# EAGLE design BackSlotAdapter (EAGLE 7.5.0)
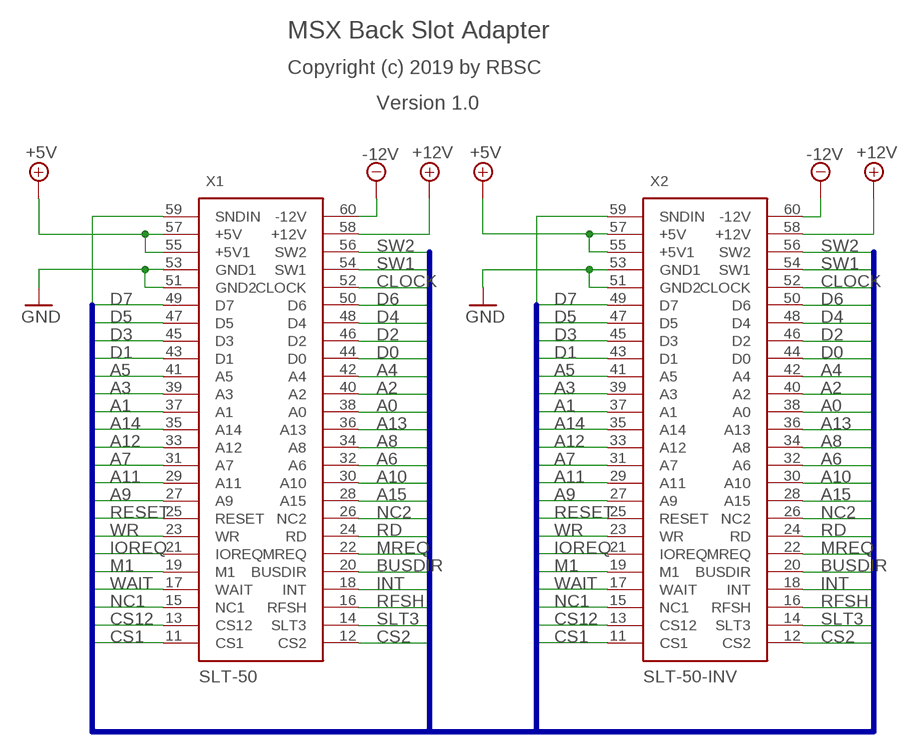
[diagram p0: schematic, sheet 1]

## Parts
X1  SLT-50  [SLT-50]
X2  SLT-50-INV  [SLT-50-INV]

## Nets
+5V: X1.55(+5V1) X1.57(+5V) X2.55(+5V1) X2.57(+5V)
+12V: X1.58(+12V) X2.58(+12V)
-12V: X1.60(-12V) X2.60(-12V)
A0: X1.38(A0) X2.38(A0)
A1: X1.37(A1) X2.37(A1)
A2: X1.40(A2) X2.40(A2)
A3: X1.39(A3) X2.39(A3)
A4: X1.42(A4) X2.42(A4)
A5: X1.41(A5) X2.41(A5)
A6: X1.32(A6) X2.32(A6)
A7: X1.31(A7) X2.31(A7)
A8: X1.34(A8) X2.34(A8)
A9: X1.27(A9) X2.27(A9)
A10: X1.30(A10) X2.30(A10)
A11: X1.29(A11) X2.29(A11)
A12: X1.33(A12) X2.33(A12)
A13: X1.36(A13) X2.36(A13)
A14: X1.35(A14) X2.35(A14)
A15: X1.28(A15) X2.28(A15)
BUSDIR: X1.20(BUSDIR) X2.20(BUSDIR)
CLOCK: X1.52(CLOCK) X2.52(CLOCK)
CS1: X1.11(CS1) X2.11(CS1)
CS2: X1.12(CS2) X2.12(CS2)
CS12: X1.13(CS12) X2.13(CS12)
D0: X1.44(D0) X2.44(D0)
D1: X1.43(D1) X2.43(D1)
D2: X1.46(D2) X2.46(D2)
D3: X1.45(D3) X2.45(D3)
D4: X1.48(D4) X2.48(D4)
D5: X1.47(D5) X2.47(D5)
D6: X1.50(D6) X2.50(D6)
D7: X1.49(D7) X2.49(D7)
GND: X1.51(GND2) X1.53(GND1) X2.51(GND2) X2.53(GND1)
INT: X1.18(INT) X2.18(INT)
IOREQ: X1.21(IOREQ) X2.21(IOREQ)
M1: X1.19(M1) X2.19(M1)
MREQ: X1.22(MREQ) X2.22(MREQ)
NC1: X1.15(NC1) X2.15(NC1)
NC2: X1.26(NC2) X2.26(NC2)
RD: X1.24(RD) X2.24(RD)
RESET: X1.25(RESET) X2.25(RESET)
RFSH: X1.16(RFSH) X2.16(RFSH)
SLT3: X1.14(SLT3) X2.14(SLT3)
SNDIN: X1.59(SNDIN) X2.59(SNDIN)
SW1: X1.54(SW1) X2.54(SW1)
SW2: X1.56(SW2) X2.56(SW2)
WAIT: X1.17(WAIT) X2.17(WAIT)
WR: X1.23(WR) X2.23(WR)

## Buses
D0,D1,D2,D3,D4,D5,D6,D7,A0,A1,A2,A3,A4,A5,A6,A7,A8,A9,A10,A11,A12,A13,A14,A15,CS1,CS2,CS12,SLT3,RFSH,WAIT,INT,M1,BUSDIR,IOREQ,MREQ,WR,RD,RESET,GND,CLOCK,SW1,SW2,SNDIN,NC2,NC1

## Notes on the sheet
- MSX Back Slot Adapter
- Copyright (c) 2019 by RBSC
- Version 1.0

## Library data of the parts
X1 = slt-50:SLT-50: 50-pin connector side slot
X2 = slt-50-inv:SLT-50-INV: 50-pin connector side slot

## Board
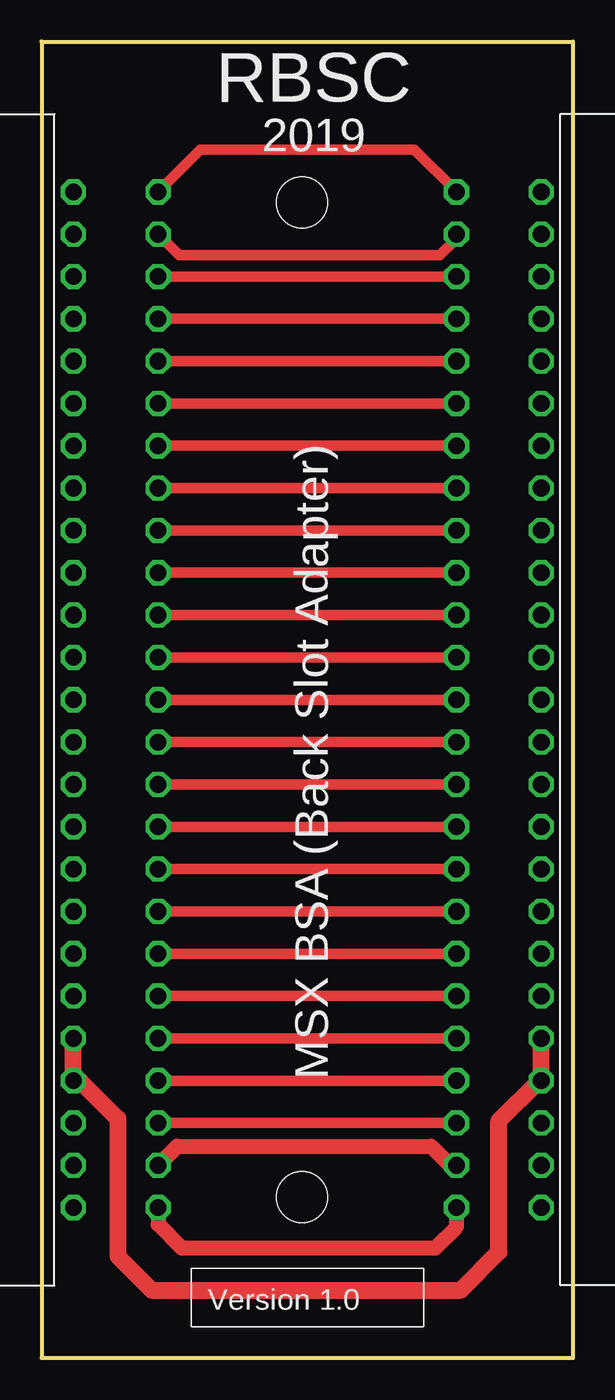
[diagram p1: board, top side]
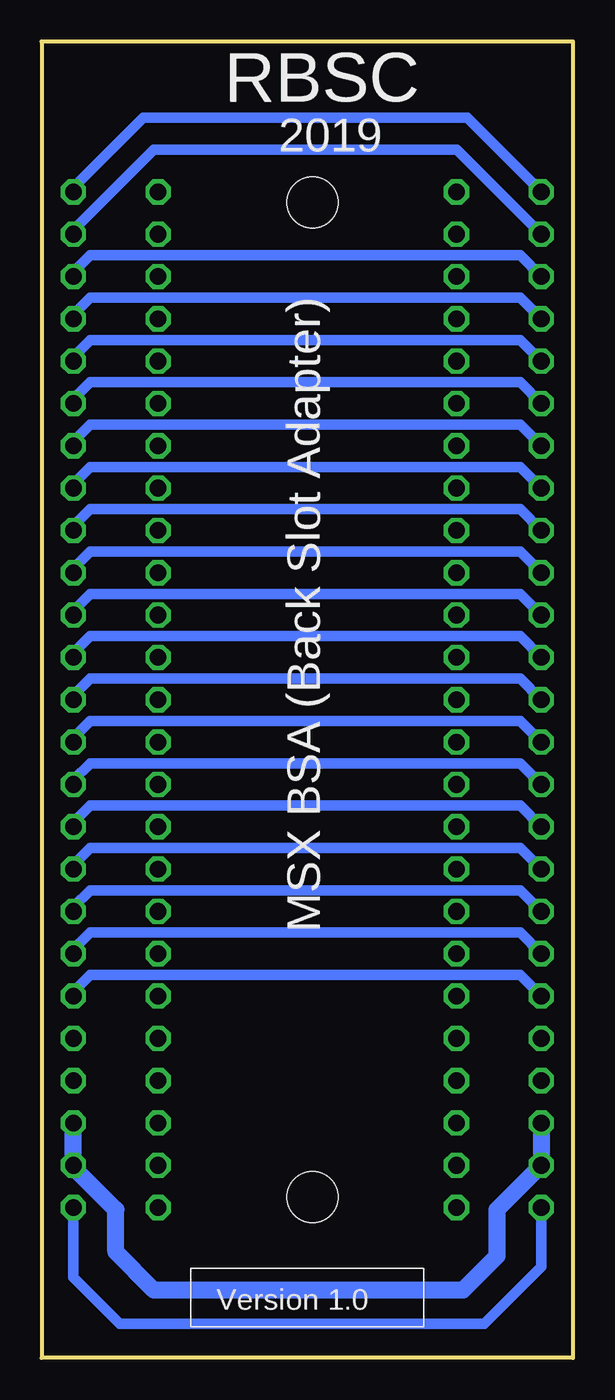
[diagram p2: board, bottom side, seen from below]

Size 31.88 x 78.99 mm. Coordinates in mm from the lower left corner, seen from the top.
Outline: 0,78.99 0,0 31.88,0 31.88,78.99 0,78.99
Copper layers (1*16): Top 0.035mm / dielectric 1.5mm / Bottom 0.035mm
Design rules "default *": minimum track width 10mil, minimum drill 24mil, track to track 7mil, track to pad 8mil, pad to pad 8mil, via to via 8mil, smd to smd 8mil, copper to edge 4mil, drill to drill 8mil, minimum pad ring 10mil, minimum via ring 8mil, stop-mask expansion 4mil, vias tented up to drill 24mil, thermal gap 10mil
Holes 3.05 mm at 15.62,9.65 15.62,69.34

### Footprints (pad centres in the part's own frame; a part is rotated, then mirrored left to right if it is on the bottom)
SLT-50 = drill 1 octagon: 11 -24.13,6.35; 12 -24.13,1.27; 13 -21.59,6.35; 14 -21.59,1.27; 15 -19.05,6.35; 16 -19.05,1.27; 17 -16.51,6.35; 18 -16.51,1.27; 19 -13.97,6.35; 20 -13.97,1.27; 21 -11.43,6.35; 22 -11.43,1.27; 23 -8.89,6.35; 24 -8.89,1.27; 25 -6.35,6.35; 26 -6.35,1.27; 27 -3.81,6.35; 28 -3.81,1.27; 29 -1.27,6.35; 30 -1.27,1.27; 31 1.27,6.35; 32 1.27,1.27; 33 3.81,6.35; 34 3.81,1.27; 35 6.35,6.35; 36 6.35,1.27; 37 8.89,6.35; 38 8.89,1.27; 39 11.43,6.35; 40 11.43,1.27; 41 13.97,6.35; 42 13.97,1.27; 43 16.51,6.35; 44 16.51,1.27; 45 19.05,6.35; 46 19.05,1.27; 47 21.59,6.35; 48 21.59,1.27; 49 24.13,6.35; 50 24.13,1.27; 51 26.67,6.35; 52 26.67,1.27; 53 29.21,6.35; 54 29.21,1.27; 55 31.75,6.35; 56 31.75,1.27; 57 34.29,6.35; 58 34.29,1.27; 59 36.83,6.35; 60 36.83,1.27
SLT-50-INV = drill 1 octagon: 11 -24.13,6.35; 12 -24.13,1.27; 13 -21.59,6.35; 14 -21.59,1.27; 15 -19.05,6.35; 16 -19.05,1.27; 17 -16.51,6.35; 18 -16.51,1.27; 19 -13.97,6.35; 20 -13.97,1.27; 21 -11.43,6.35; 22 -11.43,1.27; 23 -8.89,6.35; 24 -8.89,1.27; 25 -6.35,6.35; 26 -6.35,1.27; 27 -3.81,6.35; 28 -3.81,1.27; 29 -1.27,6.35; 30 -1.27,1.27; 31 1.27,6.35; 32 1.27,1.27; 33 3.81,6.35; 34 3.81,1.27; 35 6.35,6.35; 36 6.35,1.27; 37 8.89,6.35; 38 8.89,1.27; 39 11.43,6.35; 40 11.43,1.27; 41 13.97,6.35; 42 13.97,1.27; 43 16.51,6.35; 44 16.51,1.27; 45 19.05,6.35; 46 19.05,1.27; 47 21.59,6.35; 48 21.59,1.27; 49 24.13,6.35; 50 24.13,1.27; 51 26.67,6.35; 52 26.67,1.27; 53 29.21,6.35; 54 29.21,1.27; 55 31.75,6.35; 56 31.75,1.27; 57 34.29,6.35; 58 34.29,1.27; 59 36.83,6.35; 60 36.83,1.27

### Placement (x,y rotation side)
X1  8.26,45.85 270 bottom
X2  23.62,45.85 270 top

### Tracks (layer width: path | path; a pad name or v marks a point on that pad's centre or on a via)
+5V
  Bottom 1.016: X1.55 X1.57 4.57,8.89 4.57,6.1 6.6,4.06 25.15,4.06 27.43,6.35 27.43,8.89 29.97,11.43 X2.57 X2.55
+12V
  Top 0.889: X1.58 8.13,12.7 23.37,12.7 24.51,11.56 X2.58
-12V
  Top 0.889: X1.60 6.98,8 8.38,6.6 23.62,6.6 24.89,7.87 X2.60
A0
  Top 0.635: X1.38 X2.38
A1
  Bottom 0.635: X1.37 3.17,38.23 28.96,38.23 29.97,37.21 X2.37
A2
  Top 0.635: X1.40 X2.40
A3
  Bottom 0.635: X1.39 3.17,35.69 28.96,35.69 29.97,34.67 X2.39
A4
  Top 0.635: X1.42 X2.42
A5
  Bottom 0.635: X1.41 3.17,33.15 28.96,33.15 29.97,32.13 X2.41
A6
  Top 0.635: X1.32 X2.32
A7
  Bottom 0.635: X1.31 3.17,45.85 28.96,45.85 29.97,44.83 X2.31
A8
  Top 0.635: X1.34 X2.34
A9
  Bottom 0.635: X1.27 3.17,50.93 28.96,50.93 29.97,49.91 X2.27
A10
  Top 0.635: X1.30 X2.30
A11
  Bottom 0.635: X1.29 3.17,48.39 28.96,48.39 29.97,47.37 X2.29
A12
  Bottom 0.635: X1.33 3.17,43.31 28.96,43.31 29.97,42.29 X2.33
A13
  Top 0.635: X1.36 X2.36
A14
  Bottom 0.635: X1.35 3.17,40.77 28.96,40.77 29.97,39.75 X2.35
A15
  Top 0.635: X1.28 X2.28
BUSDIR
  Top 0.635: X1.20 X2.20
CLOCK
  Top 0.635: X1.52 X2.52
CS1
  Bottom 0.635: X1.11 6.35,74.42 25.78,74.42 29.97,70.23 X2.11
CS2
  Top 0.635: X1.12 9.53,72.52 22.35,72.52 X2.12
CS12
  Bottom 0.635: X1.13 6.98,72.52 25.15,72.52 29.97,67.69 X2.13
D0
  Top 0.635: X1.44 X2.44
D1
  Bottom 0.635: X1.43 3.17,30.61 28.96,30.61 29.97,29.59 X2.43
D2
  Top 0.635: X1.46 X2.46
D3
  Bottom 0.635: X1.45 3.17,28.07 28.96,28.07 29.97,27.05 X2.45
D4
  Top 0.635: X1.48 X2.48
D5
  Bottom 0.635: X1.47 3.17,25.53 28.96,25.53 29.97,24.51 X2.47
D6
  Top 0.635: X1.50 X2.50
D7
  Bottom 0.635: X1.49 3.17,22.99 28.96,22.99 29.97,21.97 X2.49
GND
  Top 1.016: X1.51 X1.53 2.29,16.64 4.57,14.35 4.57,6.1 6.6,4.06 25.15,4.06 27.43,6.35 27.43,14.22 29.84,16.64 X2.53 X2.51
INT
  Top 0.635: X1.18 X2.18
IOREQ
  Bottom 0.635: X1.21 3.17,58.55 28.96,58.55 29.97,57.53 X2.21
M1
  Bottom 0.635: X1.19 3.17,61.09 28.96,61.09 30.23,59.82 X2.19
MREQ
  Top 0.635: X1.22 X2.22
NC1
  Bottom 0.635: X1.15 3.17,66.17 28.96,66.17 29.97,65.15 X2.15
NC2
  Top 0.635: X1.26 X2.26
RD
  Top 0.635: X1.24 X2.24
RESET
  Bottom 0.635: X1.25 3.17,53.47 28.96,53.47 29.97,52.45 X2.25
RFSH
  Top 0.635: X1.16 X2.16
SLT3
  Top 0.635: X1.14 8.26,66.17 23.88,66.17 24.89,67.18 X2.14
SNDIN
  Bottom 0.635: X1.59 1.9,5.46 5.33,2.03 27.18,2.03 29.97,4.83 X2.59
SW1
  Top 0.635: X1.54 X2.54
SW2
  Top 0.635: X1.56 X2.56
WAIT
  Bottom 0.635: X1.17 3.17,63.63 28.96,63.63 29.97,62.61 X2.17
WR
  Bottom 0.635: X1.23 3.17,56.01 28.96,56.01 29.97,54.99 X2.23

### Text on the board
tNames: RBSC | 2019 | MSX BSA (Back Slot Adapter) | Version 1.0
bNames: RBSC | 2019 | MSX BSA (Back Slot Adapter) | Version 1.0